# EAGLE schematic trackuino micro sensor chip mk2 (EAGLE 7.3.0)
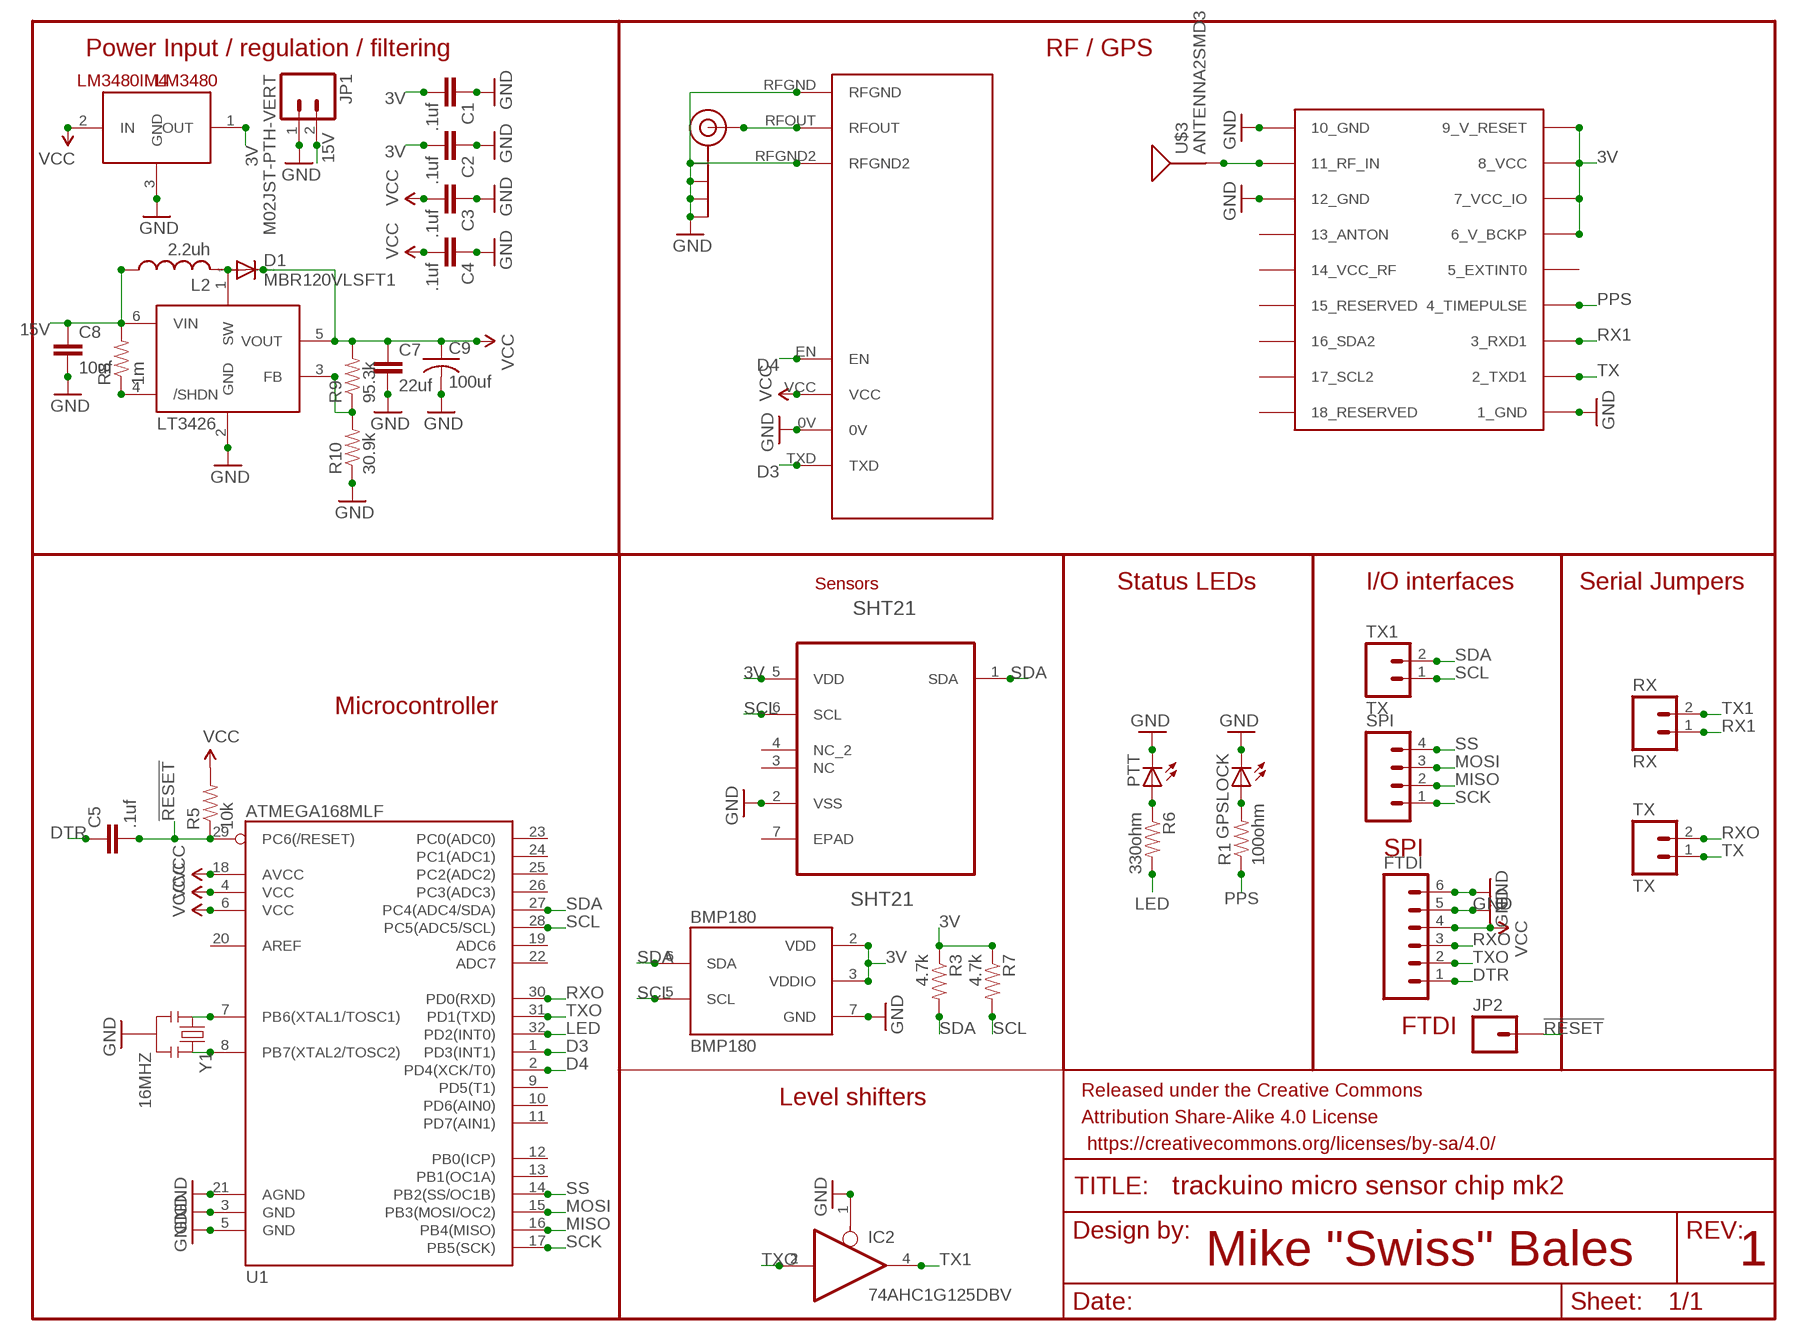
[diagram p0: schematic, sheet 1]

## Parts
BMP180  BMP180  [BMP180]
C1  .1uf  CAP0805  [0805]
C2  .1uf  CAP0805  [0805]
C3  .1uf  CAP0805  [0805]
C4  .1uf  CAP0805  [0805]
C5  .1uf  CAP0805  [0805]
C7  22uf  CAP0805  [0805]
C8  10uf  CAP0805  [0805]
C9  100uf  C-USC1206  [C1206]
D1  MBR120VLSFT1  DIODE-SOD123  [SOD123]
FRAME1  FRAME-LETTER  [CREATIVE_COMMONS]
FTDI  M06NO_SILK_FEMALE_PTH  [1X06_NO_SILK]
GPSLOCK  LEDCHIP-LED0805  [CHIP-LED0805]
IC2  74AHC1G125DBV  [SOT23-5]
J$1  SMA_EDGE  [SMA-EDGE]
JP1  M02JST-PTH-VERT  [JST-2-PTH-VERT]
JP2  M01PTH  [1X01]
L2  2.2uh  L-USL1812  [L1812]
LM3480  LM3480IM4  [SOT23-3]
LT3426  LT3426  [SOT23-6]
PTT  LEDCHIP-LED0805  [CHIP-LED0805]
R1  100ohm  RESISTOR0805-RES  [0805]
R3  4.7k  RESISTOR0805-RES  [0805]
R5  10k  RESISTOR0805-RES  [0805]
R6  330ohm  RESISTOR0805-RES  [0805]
R7  4.7k  RESISTOR0805-RES  [0805]
R8  1m  RESISTOR0805-RES  [0805]
R9  95.3k  RESISTOR0805-RES  [0805]
R10  30.9k  RESISTOR0805-RES  [0805]
RX  RX  M02JST-PTH-VERT  [JST-2-PTH-VERT]
SHT21  SHT21  [DFN300X300X110-7N]
SPI  M04JST-PTH-VERT  [JST-4-PTH-VERT]
TX  TX  M02JST-PTH-VERT  [JST-2-PTH-VERT]
TX1  TX  M02JST-PTH-VERT  [JST-2-PTH-VERT]
U1  ATMEGA168MLF  [MLF32]
U$1  UBLOX_MAX  [UBLOX_MAX]
U$2  RADIOMETRIX-HX1  [RADIOMETRIX-HX1]
U$3  ANTENNA2SMD3  [ANTENNA-CHIP4]
Y1  16MHZ  RESONATOR16MHZ  [RESONATOR-SMD]

## Nets
3V: BMP180.2(VDD) BMP180.3(VDDIO) C1.2 C2.2 LM3480.1(OUT) R3.1 R7.1 SHT21.5(VDD) U$1.6_V_BCKP U$1.7_VCC_IO U$1.8_VCC U$1.9_V_RESET
15V: C8.1 JP1.2 L2.1 LT3426.6(VIN) R8.2
!RESET: C5.2 JP2.1 R5.1 U1.29(PC6(/RESET))
D3: U1.1(PD3(INT1)) U$2.TXD
D4: U1.2(PD4(XCK/T0)) U$2.EN
DTR: C5.1 FTDI.1
GND: BMP180.7(GND) C1.1 C2.1 C3.1 C4.1 C7.2 C8.2 C9.2 FTDI.5 FTDI.6 GPSLOCK.C IC2.1(OE) J$1.GND@0(GND) J$1.GND@1(GND) J$1.GND@2(GND) J$1.GND@3(GND) JP1.1 LM3480.3(GND) LT3426.2(GND) PTT.C R10.1 SHT21.2(VSS) U1.3(GND) U1.5(GND) U1.21(AGND) U$1.1_GND U$1.10_GND U$1.12_GND U$2.0V U$2.RFGND U$2.RFGND2 Y1.2
LED: R6.2 U1.32(PD2(INT0))
MISO: SPI.2 U1.16(PB4(MISO))
MOSI: SPI.3 U1.15(PB3(MOSI/OC2))
N$1: J$1.SIG(SIGNAL) U$2.RFOUT
N$3: GPSLOCK.A R1.2
N$6: U$1.11_RF_IN U$3.SIG(SIGNAL)
N$9: D1.A L2.2 LT3426.1(SW)
N$12: LT3426.4(/SHDN) R8.1
N$13: LT3426.3(FB) R9.1 R10.2
N$14: U1.8(PB7(XTAL2/TOSC2)) Y1.3
N$26: U1.7(PB6(XTAL1/TOSC1)) Y1.1
N$27: PTT.A R6.1
PPS: R1.1 U$1.4_TIMEPULSE
RX1: RX.1 U$1.3_RXD1
RXO: FTDI.3 TX.2 U1.30(PD0(RXD))
SCK: SPI.1 U1.17(PB5(SCK))
SCL: BMP180.5(SCL) R7.2 SHT21.6(SCL) TX1.1 U1.28(PC5(ADC5/SCL))
SDA: BMP180.6(SDA) R3.2 SHT21.1(SDA) TX1.2 U1.27(PC4(ADC4/SDA))
SS: SPI.4 U1.14(PB2(SS/OC1B))
TX: TX.1 U$1.2_TXD1
TX1: IC2.4(O) RX.2
TXO: FTDI.2 IC2.2(I) U1.31(PD1(TXD))
VCC: C3.2 C4.2 C7.1 C9.1 D1.C FTDI.4 LM3480.2(IN) LT3426.5(VOUT) R5.2 R9.2 U1.4(VCC) U1.6(VCC) U1.18(AVCC) U$2.VCC
Unconnected: SHT21.3(NC) SHT21.4(NC_2) SHT21.7(EPAD) U1.9(PD5(T1)) U1.10(PD6(AIN0)) U1.11(PD7(AIN1)) U1.12(PB0(ICP)) U1.13(PB1(OC1A)) U1.19(ADC6) U1.20(AREF) U1.22(ADC7) U1.23(PC0(ADC0)) U1.24(PC1(ADC1)) U1.25(PC2(ADC2)) U1.26(PC3(ADC3)) U$1.5_EXTINT0 U$1.13_ANTON U$1.14_VCC_RF U$1.15_RESERVED U$1.16_SDA2 U$1.17_SCL2 U$1.18_RESERVED

## Notes on the sheet
- Power Input / regulation / filtering | RF / GPS
- Sensors | Status LEDs | I/O interfaces | Serial Jumpers
- Microcontroller
- SPI
- FTDI
- Level shifters
- Mike "Swiss" Bales | 1

## Power pins joined to a net without a drawn wire
GND: IC2.3(GND)
VCC: IC2.5(VCC)

## Library data of the parts
BMP180 = SparkFun-Sensors:BMP180: BOSCH BMP180 DIGITAL BAROMETRIC PRESSURE SENSOR Web page: http://www.bosch-sensortec.com/en/homepage/products_3/environmental_sensors_1/bmp180_1/bmp180 Datasheet: http://ae-bst.resource.bosch.com/media/products/dokumente/bmp180/BST-BMP180-DS000-09.pdf The BMP180 is the function compatible successor of the BMP085, a new generation of high precision digital pressure sensors for consumer applications. The ultra-low power, low voltage electronics of the BMP180 is optimized for use in mobile phones, PDAs, GPS navigation devices and outdoor equipment. With a low altitude noise of merely 0.25m at fast conversion time, the BMP180 offers superior performance. The I2C interface allows for easy system integration with a microcontroller. The BMP180 is based on piezo-resistive technology for EMC robustness, high accuracy and linearity as well as long term stability. Key features: - Temperature measurement included - I2C interface - Fully calibrated - Pb-free, halogen-free and RoHS compliant, - MSL 1 Basic specs: Pressure range: 300 to 1100hPa (+9000m to -500m relating to sea level) Supply voltage: 1.8 to 3.6V (VDD), 1.62V to 3.6V (VDDIO) Package: LGA package with metal lid Small footprint: 3.6mm x 3.8mm Super-flat: 0.93mm height Low power: 5μA at 1 sample / sec. in standard mode Low noise: 0.06hPa (0.5m) in ultra low power mode, 0.02hPa (0.17m) advanced resolution mode Typical applications: - Enhancement of GPS navigation (dead-reckoning, slope detection, etc.) - In- and out-door navigation - Leisure and sports - Weather forecast - Vertical velocity indication (rise/sink speed)
C1-C5 C7 C8 = SparkFun-Capacitors:CAP: Capacitor Standard 0603 ceramic capacitor, and 0.1" leaded capacitor.
C9 = resistor:C-US: CAPACITOR, American symbol
D1 = diode:DIODE-: DIODE
FRAME1 = SparkFun-Aesthetics:FRAME-LETTER: Schematic Frame Standard 8.5x11 US Letter frame
FTDI = SparkFun-Connectors:M06: Header 6 Standard 6-pin 0.1" header. Use with straight break away headers (SKU : PRT-00116), right angle break away headers (PRT-00553), swiss pins (PRT-00743), machine pins (PRT-00117), and female headers (PRT-00115). Molex polarized connector foot print use with SKU : PRT-08094 with associated crimp pins and housings. NOTES ON THE VARIANTS LOCK and LOCK_LONGPADS... This footprint was designed to help hold the alignment of a through-hole component (i.e. 6-pin header) while soldering it into place. You may notice that each hole has been shifted either up or down by 0.005 of an inch from it's more standard position (which is a perfectly straight line). This slight alteration caused the pins (the squares in the middle) to touch the edges of the holes. Because they are alternating, it causes a "brace" to hold the component in place. 0.005 has proven to be the perfect amount of "off-center" position when using our standard breakaway headers. Although looks a little odd when you look at the bare footprint, once you have a header in there, the alteration is very hard to notice. Also,if you push a header all the way into place, it is covered up entirely on the bottom side. This idea of altering the position of holes to aid alignment will be further integrated into the Sparkfun Library for other footprints. It can help hold any component with 3 or more connection pins.; PROD_ID: CONN-08437
GPSLOCK PTT = adafruit:LED: LED OSRAM: - CHIPLED LG R971, LG N971, LY N971, LG Q971, LY Q971, LO R971, LY R971 LH N974, LH R974 LS Q976, LO Q976, LY Q976 LO Q996 - Hyper CHIPLED LW Q18S LB Q993, LB Q99A, LB R99A - SideLED LS A670, LO A670, LY A670, LG A670, LP A670 LB A673, LV A673, LT A673, LW A673 LH A674 LY A675 LS A676, LA A676, LO A676, LY A676, LW A676 LS A679, LY A679, LG A679 - Hyper Micro SIDELED® LS Y876, LA Y876, LO Y876, LY Y876 LT Y87S - SmartLED LW L88C, LW L88S LB L89C, LB L89S, LG L890 LS L89K, LO L89K, LY L89K LS L896, LA L896, LO L896, LY L896 - TOPLED LS T670, LO T670, LY T670, LG T670, LP T670 LSG T670, LSP T670, LSY T670, LOP T670, LYG T670 LG T671, LOG T671, LSG T671 LB T673, LV T673, LT T673, LW T673 LH T674 LS T676, LA T676, LO T676, LY T676, LB T676, LH T676, LSB T676, LW T676 LB T67C, LV T67C, LT T67C, LS T67K, LO T67K, LY T67K, LW E67C LS E67B, LA E67B, LO E67B, LY E67B, LB E67C, LV E67C, LT E67C LW T67C LS T679, LY T679, LG T679 LS T770, LO T770, LY T770, LG T770, LP T770 LB T773, LV T773, LT T773, LW T773 LH T774 LS E675, LA E675, LY E675, LS T675 LS T776, LA T776, LO T776, LY T776, LB T776 LHGB T686 LT T68C, LB T68C - Hyper Mini TOPLED® LB M676 - Mini TOPLED Santana® LG M470 LS M47K, LO M47K, LY M47K Source: http://www.osram.convergy.de/
IC2 = 74xx-little-us:74*1G125: Single Bus Buffer Gate with 3-State Output
J$1 = SparkFun-Connectors:SMA_EDGE: SMA Antenna Connector End launch SMA connector. The paste layer has been removed so that the connector can be hand soldered onto the board after reflow.
JP1 RX TX TX1 = SparkFun-Connectors:M02: Standard 2-pin 0.1" header. Use with - straight break away headers ( PRT-00116) - right angle break away headers (PRT-00553) - swiss pins (PRT-00743) - machine pins (PRT-00117) - female headers (PRT-00115) Molex polarized connector foot print use with: PRT-08233 with associated crimp pins and housings. 2.54_SCREWTERM for use with PRT-10571. 3.5mm Screw Terminal footprints for PRT-08084 5mm Screw Terminal footprints for use with PRT-08432
JP2 = SparkFun-Connectors:M01: Header 1 Standard 1-pin 0.1" header. Use with straight break away headers (SKU : PRT-00116), right angle break away headers (PRT-00553), swiss pins (PRT-00743), machine pins (PRT-00117), and female headers (PRT-00115).
L2 = resistor:L-US: INDUCTOR, American symbol
LM3480 = SparkFun-PowerIC:LM3480IM4: Small package linear regulator
LT3426 = adafruit:LT3426: LT3426 1.2MHz, 2A boost converter in SOT-23 http://www.linear.com/pc/productDetail.jsp?navId=H0,C1,C1003,C1042,C1031,C1061,P8430 (Linear website)
R1 R3 R5-R10 = SparkFun-Resistors:RESISTOR: Resistor Basic schematic elements and footprints for 0603, 1206, and PTH resistors.
SHT21 = sht21:SHT21: SENSOR, HUMIDITY & TEMP; MPN: SHT21; OC_FARNELL: 1855468; OC_NEWARK: 20T1172; PACKAGE: DFN-6; SUPPLIER: SENSIRION
SPI = SparkFun-Connectors:M04: Header 4 Standard 4-pin 0.1" header. Use with straight break away headers (SKU : PRT-00116), right angle break away headers (PRT-00553), swiss pins (PRT-00743), machine pins (PRT-00117), and female headers (PRT-00115). Molex polarized connector foot print use with SKU : PRT-08231 with associated crimp pins and housings. 1MM SMD Version SKU: PRT-10208
U1 = SparkFun-DigitalIC:ATMEGA168: Atmel 32-pin 8-bit micro, 16k flash.
U$1 = Ava:UBLOX_MAX: UBLOX MAX
U$2 = Ava:RADIOMETRIX-HX1
U$3 = SparkFun-RF:ANTENNA2: Chip antenna Single endded antenna. Common with smaller chip antennas. CHIP4 package is the GPS Chip Antenna SKU: GPS-08418. CHIP5 package is 2.4GHz chip antenna SKU: WRL-00144.
Y1 = SparkFun-FreqCtrl:RESONATOR: Resonator Small SMD resonator. Used, eg, on the Arduino Pro/ Pro Mini boards. 8MHz- XTAL-08895 16MHz- XTAL-08900; PROD_ID: XTAL-08900